# EAGLE design in4_control_v1.0_revA (EAGLE 7.5.0)
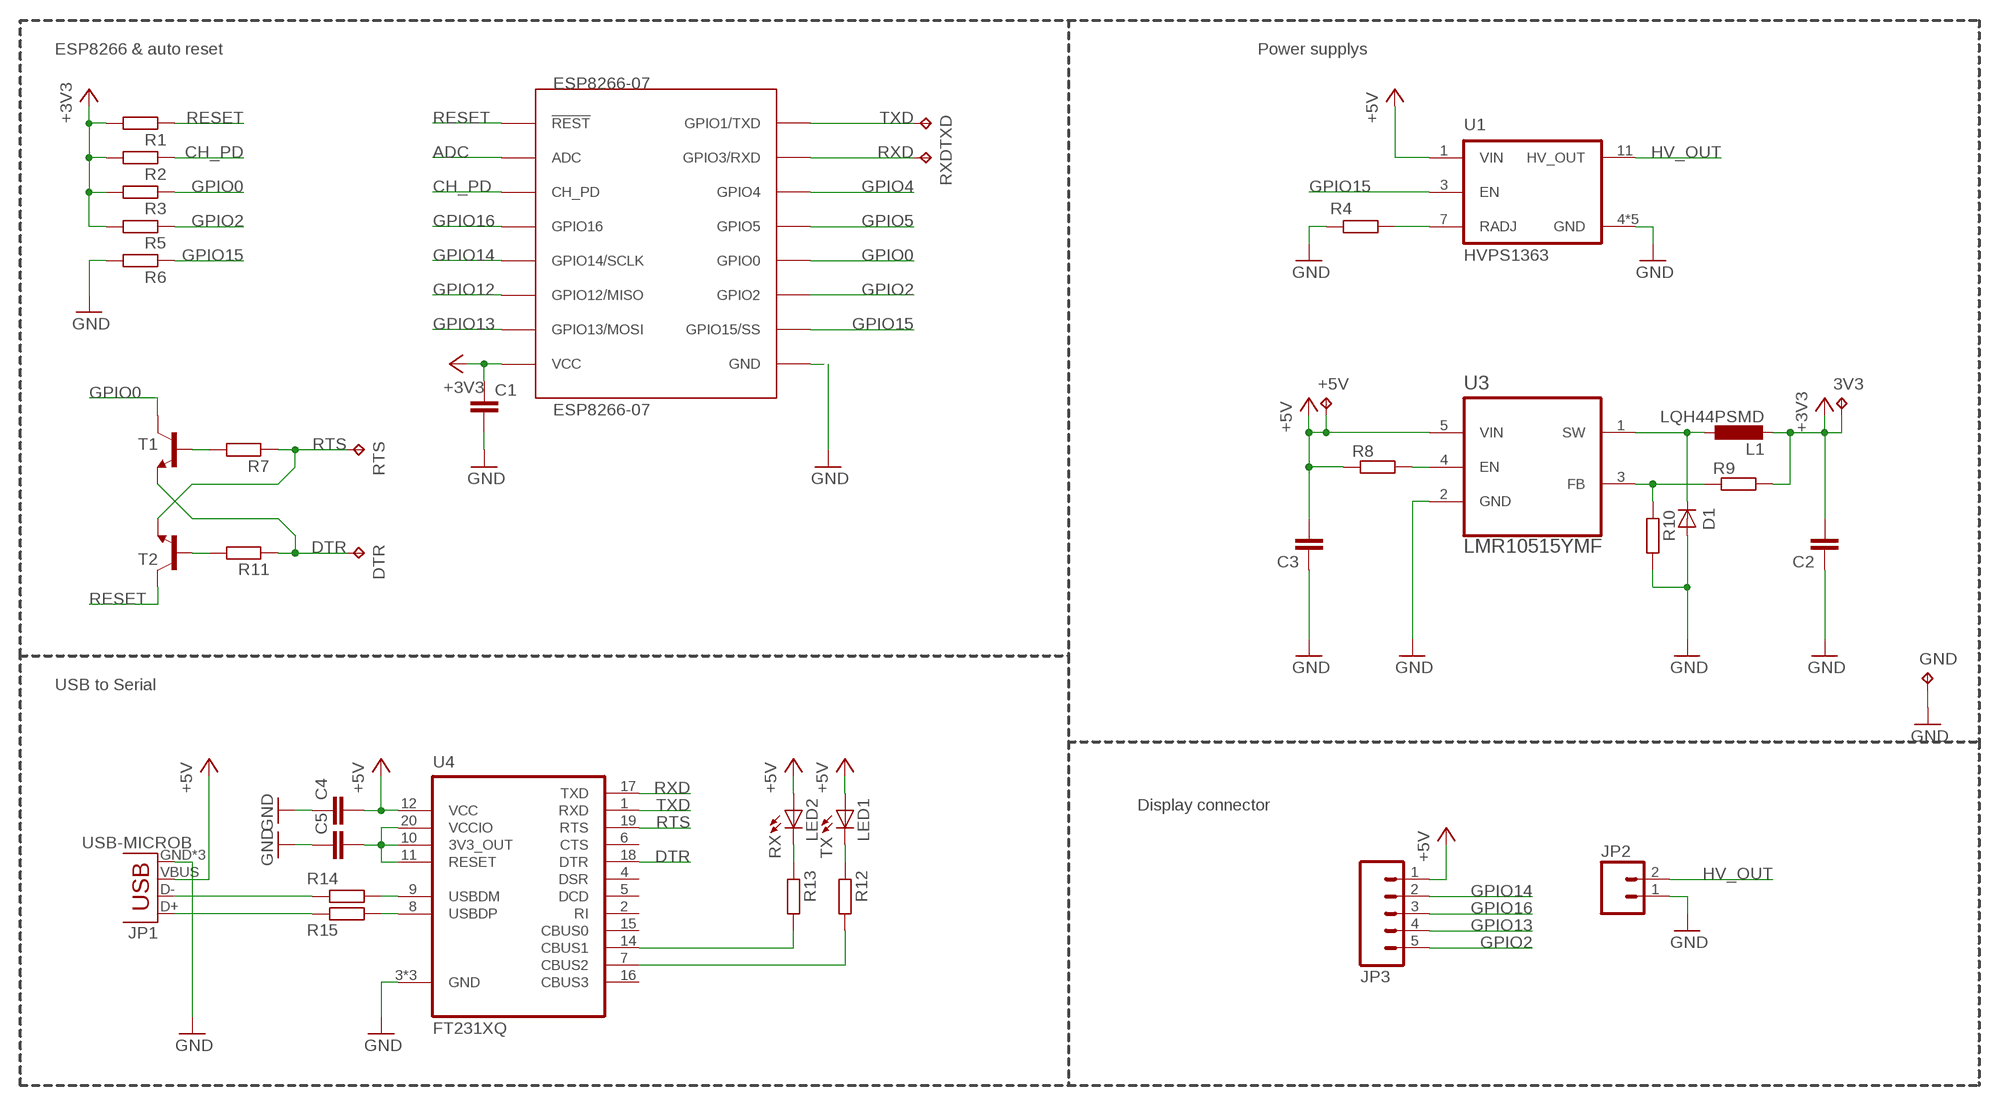
[diagram p0: schematic, sheet 1]

## Parts
3V3  TPTP15R  [TP15R]
+5V  TPTP17R  [TP17R]
C1  C-EUC0805  [C0805]
C2  C-EUC0805  [C0805]
C3  C-EUC0805  [C0805]
C4  C-EUC0603  [C0603]
C5  C-EUC0603  [C0603]
D1  DIODE-SOD-123  [SOD-123]
DTR  TPTP17R  [TP17R]
ESP8266-07  ESP8266-07  [ESP07]
GND  TPTP17R  [TP17R]
JP1  USB-MICROB  [USB-MICROB]
JP2  M021X02_NO_SILK  [1X02_NO_SILK]
JP3  M05PTH  [1X05]
L1  LQH44PSMD  [1515]
LED1  TX  LEDCHIP-LED0603  [CHIP-LED0603]
LED2  RX  LEDCHIP-LED0603  [CHIP-LED0603]
R1  R-EU_R0603  [R0603]
R2  R-EU_R0603  [R0603]
R3  R-EU_R0603  [R0603]
R4  R-EU_R0603  [R0603]
R5  R-EU_R0603  [R0603]
R6  R-EU_R0603  [R0603]
R7  R-EU_R0603  [R0603]
R8  R-EU_R0603  [R0603]
R9  R-EU_R0603  [R0603]
R10  R-EU_R0603  [R0603]
R11  R-EU_R0603  [R0603]
R12  R-EU_R0603  [R0603]
R13  R-EU_R0603  [R0603]
R14  R-EU_R0603  [R0603]
R15  R-EU_R0603  [R0603]
RTS  TPTP17R  [TP17R]
RXD  TPTP17R  [TP17R]
T1  MMBT3904LT1-NPN-SOT23-BEC  [SOT23-BEC]
T2  MMBT3904LT1-NPN-SOT23-BEC  [SOT23-BEC]
TXD  TPTP17R  [TP17R]
U1  HVPS1363  [HVPS-1363]
U3  LMR10515YMF  [SOT95P290X145-5N]
U4  FT231XQ  [QFN-20]

## Nets
+3V3: 3V3.TP C1.1 C2.2 ESP8266-07.VCC L1.2 R1.2 R2.2 R3.2 R5.2 R9.2
+5V: +5V.TP C3.2 C4.2 JP1.VBUS JP3.1 LED1.A LED2.A R8.1 U1.1(VIN) U3.5(VIN) U4.12(VCC)
ADC: ESP8266-07.ADC
CH_PD: ESP8266-07.CH_PD R2.1
DTR: DTR.TP R11.1 T1.E U4.18(DTR)
GND: C1.2 C2.1 C3.1 C4.1 C5.1 D1.A ESP8266-07.GND GND.TP JP1.GND JP1.MT1(GND) JP1.MT2(GND) JP2.1 R4.2 R6.2 R10.2 U1.4(GND) U1.6(GND) U1.8(GND) U1.9(GND) U1.10(GND) U3.2(GND) U4.3(GND) U4.13(GND) U4.21(GND)
GPIO0: ESP8266-07.GPIO0 R3.1 T1.C
GPIO2: ESP8266-07.GPIO2 JP3.5 R5.1
GPIO4: ESP8266-07.GPIO4
GPIO5: ESP8266-07.GPIO5
GPIO12: ESP8266-07.GPIO12(GPIO12/MISO)
GPIO13: ESP8266-07.GPIO13(GPIO13/MOSI) JP3.4
GPIO14: ESP8266-07.GPIO14(GPIO14/SCLK) JP3.2
GPIO15: ESP8266-07.GPIO15(GPIO15/SS) R6.1 U1.3(EN)
GPIO16: ESP8266-07.GPIO16 JP3.3
HV_OUT: JP2.2 U1.11(HV_OUT)
N$2: C5.2 U4.10(3V3_OUT) U4.11(RESET) U4.20(VCCIO)
N$3: R8.2 U3.4(EN)
N$4: R9.1 R10.1 U3.3(FB)
N$5: R14.1 U4.9(USBDM)
N$6: R15.1 U4.8(USBDP)
N$7: JP1.D+ R15.2
N$8: JP1.D- R14.2
N$9: LED2.C R13.1
N$10: LED1.C R12.1
N$11: R13.2 U4.14(CBUS1)
N$12: R12.2 U4.7(CBUS2)
N$13: R4.1 U1.7(RADJ)
N$15: R11.2 T2.B
N$16: R7.2 T1.B
RESET: ESP8266-07.REST(!REST!) R1.1 T2.C
RTS: R7.1 RTS.TP T2.E U4.19(RTS)
RXD: ESP8266-07.RXD(GPIO3/RXD) RXD.TP U4.17(TXD)
SW: D1.C L1.1 U3.1(SW)
TXD: ESP8266-07.TXD(GPIO1/TXD) TXD.TP U4.1(RXD)
Unconnected: U4.2(RI) U4.4(DSR) U4.5(DCD) U4.6(CTS) U4.15(CBUS0) U4.16(CBUS3)

## Notes on the sheet
- ESP8266 & auto reset | Power supplys
- USB to Serial
- Display connector

## Library data of the parts
3V3 +5V DTR GND RTS RXD TXD = testpad:TP: Test pad
C1 C4 C5 = resistor:C-EU: CAPACITOR, European symbol
C2 C3 = rcl:C-EU: CAPACITOR, European symbol
D1 = dp_devices:DIODE: Various Diode Packages
ESP8266-07 = custom_lbr:ESP8266-07: ESP8266 - ESP07
JP1 = SparkFun-Connectors:USB: USB Connectors USB-B-PTH is fully proven SKU : PRT-00139/CONN-08278 USB-miniB is fully proven SKU : PRT-00587 USB-A-PCB is untested. USB-A-H is throughly reviewed, but untested. Spark Fun Electronics SKU : PRT-00437 USB-B-SMT is throughly reviewed, but untested. Needs silkscreen touching up. USB-A-S has not been used/tested USB-MB-H has not been used/tested USB-MICROB has been used. CONN-09505; PROD_ID: CONN-09505
JP2 = SparkFun-Connectors:M02: Standard 2-pin 0.1" header. Use with - straight break away headers ( PRT-00116) - right angle break away headers (PRT-00553) - swiss pins (PRT-00743) - machine pins (PRT-00117) - female headers (PRT-00115) Molex polarized connector foot print use with: PRT-08233 with associated crimp pins and housings. 2.54_SCREWTERM for use with PRT-10571. 3.5mm Screw Terminal footprints for PRT-08084 5mm Screw Terminal footprints for use with PRT-08432
JP3 = SparkFun-Connectors:M05: Header 5 Standard 5-pin 0.1" header. Use with straight break away headers (SKU : PRT-00116), right angle break away headers (PRT-00553), swiss pins (PRT-00743), machine pins (PRT-00117), and female headers (PRT-00115). Molex polarized connector foot print use with SKU : PRT-08230 with associated crimp pins and housings.
L1 = custom_lbr:LQH44P: Murat LQH44 series http://www.farnell.com/datasheets/490895.pdf
LED1 LED2 = led:LED: LED OSRAM: - CHIPLED LG R971, LG N971, LY N971, LG Q971, LY Q971, LO R971, LY R971 LH N974, LH R974 LS Q976, LO Q976, LY Q976 LO Q996 - Hyper CHIPLED LW Q18S LB Q993, LB Q99A, LB R99A - SideLED LS A670, LO A670, LY A670, LG A670, LP A670 LB A673, LV A673, LT A673, LW A673 LH A674 LY A675 LS A676, LA A676, LO A676, LY A676, LW A676 LS A679, LY A679, LG A679 - Hyper Micro SIDELED® LS Y876, LA Y876, LO Y876, LY Y876 LT Y87S - SmartLED LW L88C, LW L88S LB L89C, LB L89S, LG L890 LS L89K, LO L89K, LY L89K LS L896, LA L896, LO L896, LY L896 - TOPLED LS T670, LO T670, LY T670, LG T670, LP T670 LSG T670, LSP T670, LSY T670, LOP T670, LYG T670 LG T671, LOG T671, LSG T671 LB T673, LV T673, LT T673, LW T673 LH T674 LS T676, LA T676, LO T676, LY T676, LB T676, LH T676, LSB T676, LW T676 LB T67C, LV T67C, LT T67C, LS T67K, LO T67K, LY T67K, LW E67C LS E67B, LA E67B, LO E67B, LY E67B, LB E67C, LV E67C, LT E67C LW T67C LS T679, LY T679, LG T679 LS T770, LO T770, LY T770, LG T770, LP T770 LB T773, LV T773, LT T773, LW T773 LH T774 LS E675, LA E675, LY E675, LS T675 LS T776, LA T776, LO T776, LY T776, LB T776 LHGB T686 LT T68C, LB T68C - Hyper Mini TOPLED® LB M676 - Mini TOPLED Santana® LG M470 LS M47K, LO M47K, LY M47K Source: http://www.osram.convergy.de LUXEON: - LUMILED® LXK2-PW12-R00, LXK2-PW12-S00, LXK2-PW14-U00, LXK2-PW14-V00 LXK2-PM12-R00, LXK2-PM12-S00, LXK2-PM14-U00 LXK2-PE12-Q00, LXK2-PE12-R00, LXK2-PE12-S00, LXK2-PE14-T00, LXK2-PE14-U00 LXK2-PB12-K00, LXK2-PB12-L00, LXK2-PB12-M00, LXK2-PB14-N00, LXK2-PB14-P00, LXK2-PB14-Q00 LXK2-PR12-L00, LXK2-PR12-M00, LXK2-PR14-Q00, LXK2-PR14-R00 LXK2-PD12-Q00, LXK2-PD12-R00, LXK2-PD12-S00 LXK2-PH12-R00, LXK2-PH12-S00 LXK2-PL12-P00, LXK2-PL12-Q00, LXK2-PL12-R00 Source: www.luxeon.com KINGBRIGHT: KA-3528ASYC Source: www.kingbright.com
R1-R15 = rcl:R-EU_: RESISTOR, European symbol
T1 T2 = transistor:*-NPN-: NPN Transistror BF959 corrected 2008.03.06
U1 = custom_lbr:HVPS1363: 1363 HVPS http://www.tayloredge.com/
U3 = custom_lbr:LMR10515YMF: IC, SIMPLE SWITCHER 5.5Vin, 1.5A Step-Down Voltage Regulator in SOT-23-5; MPN: LMR10515YMF; OC_FARNELL: 2064684; OC_NEWARK: 75T7391; PACKAGE: SOT-23-5; SUPPLIER: TEXAS INSTRUMENTS
U4 = custom_lbr:FT231XQ: FTDI FT231XQ USB Interface

## Net classes
1 HV: width 0.61 mm, drill 0.33 mm, clearance 0.406 mm

## Board
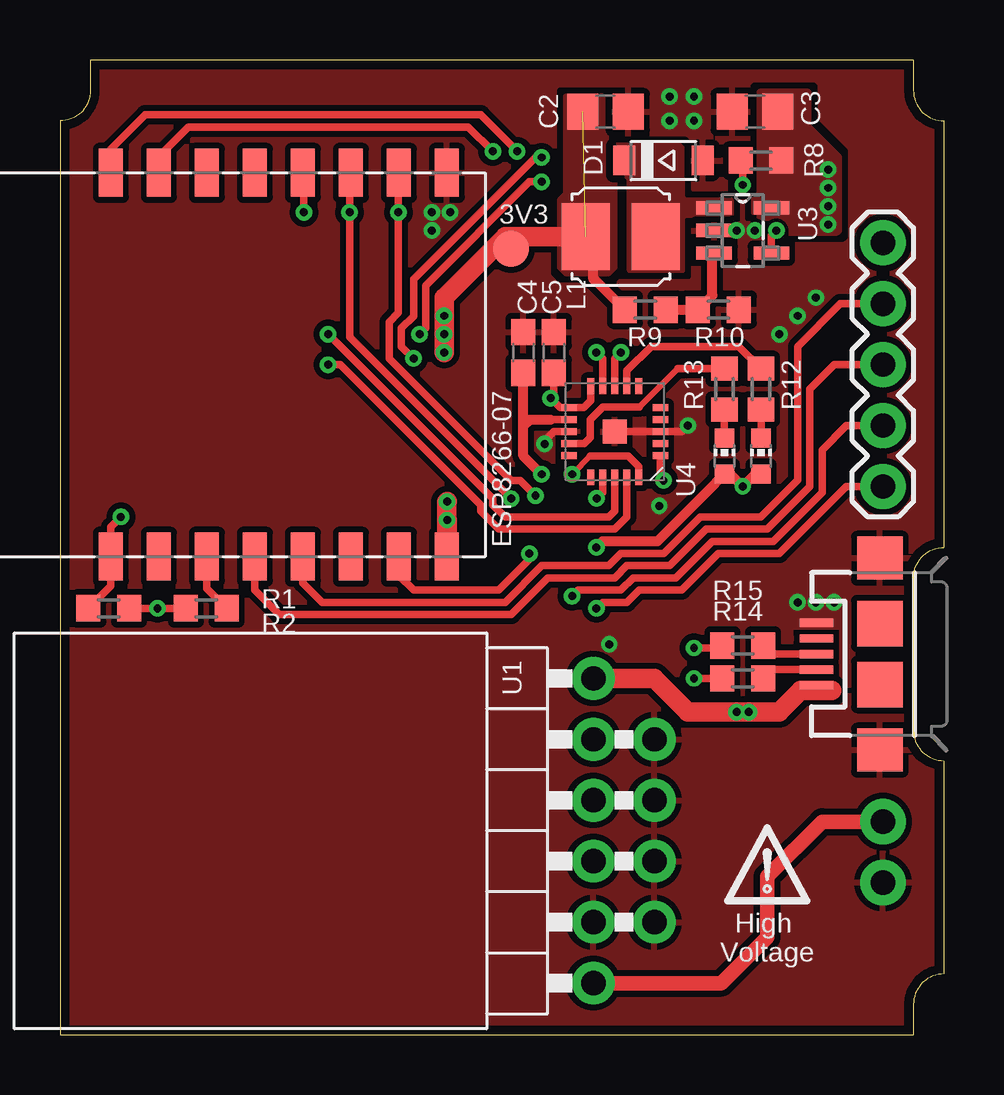
[diagram p1: board, top side]
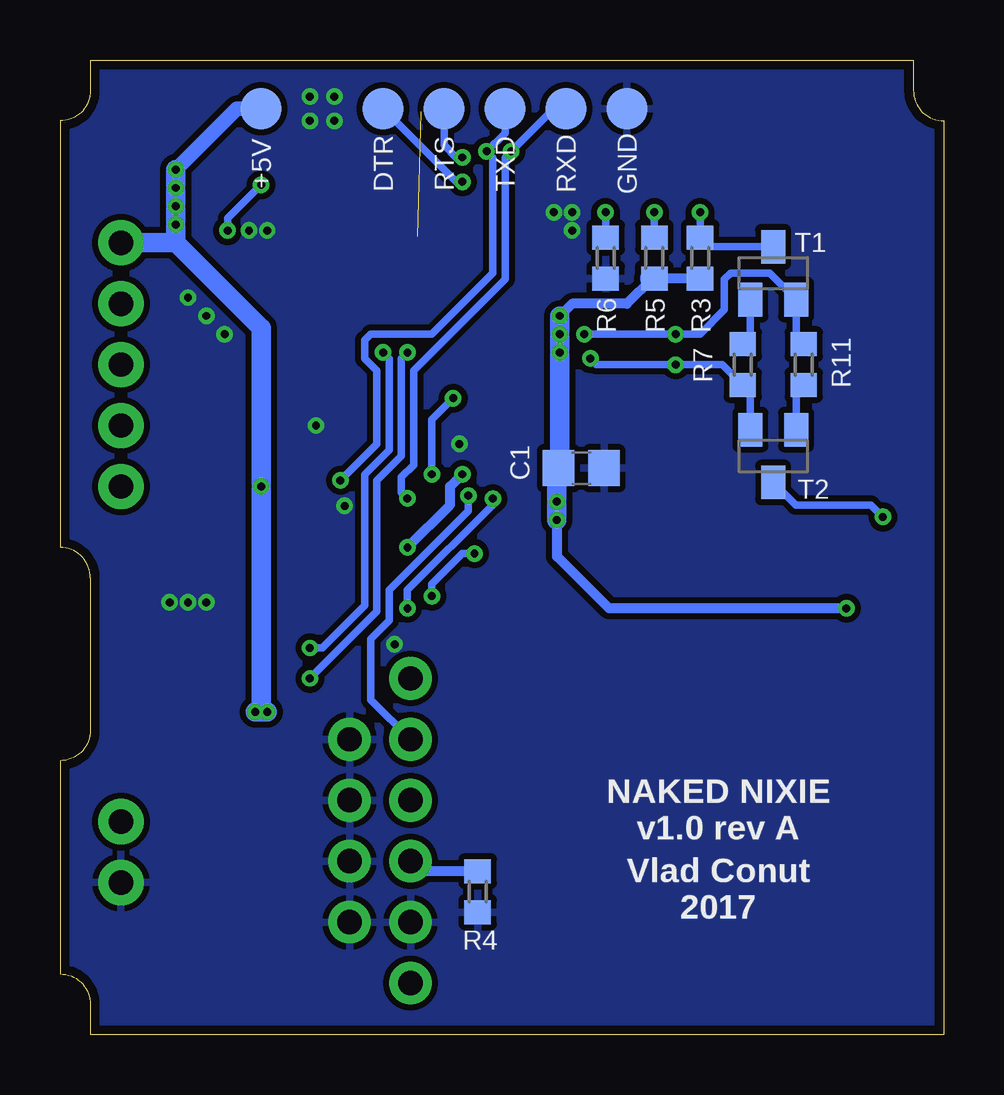
[diagram p2: board, bottom side, seen from below]

Size 36.83 x 40.64 mm. Coordinates in mm from the lower left corner, seen from the top.
Outline: 0,0 35.56,0 35.56,1.27 arc-90 36.83,2.54 36.83,11.43 arc-90 35.56,12.7 35.56,19.05 arc-90 36.83,20.32 36.83,38.1 arc-90 35.56,39.37 35.56,40.64 1.27,40.64 1.27,39.37 arc-90 0,38.1 0,0
Copper layers (1*16): Top 0.0356mm / dielectric 1.5288mm / Bottom 0.0356mm
Design rules "OSHPARK_mod *": minimum track width 6mil, minimum drill 13mil, track to track 6mil, track to pad 6mil, pad to pad 6mil, via to via 6mil, smd to smd 0mil, copper to edge 15mil, drill to drill 6mil, minimum pad ring 10mil, minimum via ring 7mil, stop-mask expansion 3mil, vias tented up to drill 20mil, thermal gap 10mil

### Footprints (pad centres in the part's own frame; a part is rotated, then mirrored left to right if it is on the bottom)
TP15R = smd 1.5 x 1.5: TP 0,0
TP17R = smd 1.7 x 1.7: TP 0,0
C0805 = smd 1.3 x 1.5: 1 -0.95,0; 2 0.95,0
C0603 = smd 1.1 x 1: 1 -0.85,0; 2 0.85,0
SOD-123 = smd 0.91 x 1.22: A 1.635,0; C -1.635,0
ESP07 = smd 1 x 2: ADC -2.87,-8; CH_PD -0.87,-8; GND 9.13,8; GPIO0 3.13,8; GPIO2 5.13,8; GPIO4 -0.87,8; GPIO5 1.13,8; GPIO12 5.13,-8; GPIO13 7.13,-8; GPIO14 3.13,-8; GPIO15 7.13,8; GPIO16 1.13,-8; REST -4.87,-8; RXD -2.87,8; TXD -4.87,8; VCC 9.13,-8
USB-MICROB = smd 0.35 x 1.4: D+ 0,2.65; D- -0.65,2.65; GND 1.3,2.65; ID 0.65,2.65; VBUS -1.3,2.65 | smd 1.8 x 1.9: MT1 -4,0; MT2 4,0 | smd 1.9 x 1.9: P$1 -1.27,0; P$2 1.27,0
1X02_NO_SILK = drill 1.016 pad 1.88: 1 0,0; 2 2.54,0
1X05 = drill 1.016 pad 1.88: 1 0,0; 2 2.54,0; 3 5.08,0; 4 7.62,0; 5 10.16,0
1515 = smd 2 x 2.8: 1 -1.454,0; 2 1.454,0
CHIP-LED0603 = smd 0.8 x 0.8: A 0,-0.75; C 0,0.75
R0603 = smd 1 x 1.1: 1 -0.85,0; 2 0.85,0
SOT23-BEC = smd 1 x 1.4: B -0.95,-1.1; C 0,1.1; E 0.95,-1.1
HVPS-1363 = drill 1.016 pad 1.778: 1 0,-6.35; 3 0,-3.81; 4 -2.54,-3.81; 5 0,-1.27; 6 -2.54,-1.27; 7 0,1.27; 8 -2.54,1.27; 9 0,3.81; 10 -2.54,3.81; 11 0,6.35
SOT95P290X145-5N = smd 1.473 x 0.559: 1 -1.194,0.94; 2 -1.194,0; 3 -1.194,-0.94; 4 1.194,-0.94; 5 1.194,0.94
QFN-20 = smd 0.65 x 0.3: 1 -1.9,1; 2 -1.9,0.5; 3 -1.9,0; 4 -1.9,-0.5; 5 -1.9,-1; 11 1.9,-1; 12 1.9,-0.5; 13 1.9,0; 14 1.9,0.5; 15 1.9,1 | smd 0.3 x 0.65: 6 -1,-1.9; 7 -0.5,-1.9; 8 0,-1.9; 9 0.5,-1.9; 10 1,-1.9; 16 1,1.9; 17 0.5,1.9; 18 0,1.9; 19 -0.5,1.9; 20 -1,1.9 | smd 1 x 1: 21 0,0

### Placement (x,y rotation side)
3V3  18.8,32.77 0 top
+5V  28.45,38.61 0 bottom
C1  15.11,23.62 0 bottom
C2  22.73,38.48 180 top
C3  28.96,38.48 0 top
C4  19.3,28.45 270 top
C5  20.57,28.45 270 top
D1  25.15,36.45 0 top
DTR  23.37,38.61 0 bottom
ESP8266-07  6.99,27.94 0 top
GND  13.21,38.61 0 bottom
JP1  34.16,15.88 90 top
JP2  34.29,6.35 90 top
JP3  34.29,33.02 270 top
L1  23.37,33.27 180 top
LED1  29.21,24.13 0 top
LED2  27.69,24.13 0 top
R1  2.03,17.78 0 top
R2  6.1,17.78 180 top
R3  10.16,32.38 270 bottom
R4  19.43,5.97 270 bottom
R5  12.06,32.38 270 bottom
R6  14.1,32.38 270 bottom
R7  8.38,27.94 90 bottom
R8  29.21,36.45 180 top
R9  24.38,30.23 180 top
R10  27.43,30.23 0 top
R11  5.84,27.94 270 bottom
R12  29.21,26.92 90 top
R13  27.69,26.92 90 top
R14  28.45,14.86 0 top
R15  28.45,16.23 0 top
RTS  20.83,38.61 0 bottom
RXD  15.75,38.61 0 bottom
T1  7.11,31.75 0 bottom
T2  7.11,24.13 180 bottom
TXD  18.29,38.61 0 bottom
U1  22.23,8.51 180 top
U3  28.45,33.53 0 top
U4  23.11,25.15 180 top
U$1  [DANGER_LOGO]  29.46,6.1 0 top

### Tracks (layer width: path | path; a pad name or v marks a point on that pad's centre or on a via)
+3V3  (via drill 0.33)  (1 unrouted)
  Top 0.305: R1.2 v4.06,17.78 R2.2
  Top 0.406: 23.5,30.23 R9.2 22.26,31.5 22.23,31.5 22.23,32.96 L1.2
  Top 0.813: v16,28.45 v16,29.21 v16,29.97 16,30.73 18.54,33.27 18.8,33.27 | v16.13,22.23 16.11,22.21 ESP8266-07.VCC 16.13,19.95 v16.13,21.46 | L1.2 18.8,33.27 | 3V3.TP 18.8,33.27
  Bottom 0.406: v4.06,17.78 13.96,17.78 ESP8266-07.VCC 16.11,21.45 v16.13,21.46 | R3.2 R5.2 | 12.15,31.54 13.21,30.48 15.49,30.48 v16,29.97
  Bottom 0.813: v16,29.97 v16,29.21 v16,28.45 16,23.68 C1.1 16.13,23.56 v16.13,21.46
  Bottom 1.016: R5.2 12.15,31.54
  pour Top (isolate 0.305, no thermals): 21.08,39.12 21.08,35.05 20.83,34.8 20.83,32 21.08,31.75 22.86,31.75 23.11,32 23.11,37.59 22.61,38.1 22.61,39.12
+5V  (via drill 0.33)
  Top 0.254: 31.69,14.57 32.15,14.37 | JP1.VBUS 31.51,14.37 31.5,14.35 | LED2.A 27.93,23.38 | LED1.A 28.97,23.38
  Top 0.305: U4.12 20.33,25.65 20.45,25.64
  Top 0.406: LED2.A 26.92,22.61 24.89,20.57 22.61,20.57 v22.35,20.32 | v20.07,23.37 19.3,24.13 19.3,25.4 | 19.3,25.4 C4.2 | 27.93,23.38 v28.45,22.86 28.97,23.38 | 20.45,25.64 19.54,25.64 19.3,25.4
  Top 0.813: 32.15,14.37 31.62,14.35 31.5,14.35 30.86,14.35 29.97,13.46 v28.7,13.46 v28.19,13.46 26.16,13.46 24.77,14.86 U1.1
  Bottom 0.406: v22.35,20.32 20.57,22.1 20.57,22.86 v20.07,23.37
  Bottom 0.61: +5V.TP 29.46,38.61 v32,36.07
  Bottom 0.813: 32,33.02 28.45,29.46 v28.45,22.86 28.45,13.72 v28.19,13.46 v28.7,13.46 | 32,33.02 v32,33.78 v32,34.54 v32,35.31 v32,36.07 | JP3.1 32,33.02
  pour Top (isolate 0.254, no thermals): 28.96,34.29 28.96,34.8 29.21,34.8
  pour Top (no thermals): 29.21,39.24 29.21,33.53 32.38,33.53 32.38,36.58 31.11,37.85 31.11,39.24
CH_PD
  Top 0.305: ESP8266-07.CH_PD 6.12,18.61 R2.1
DTR  (via drill 0.33)
  Top 0.305: U4.18 23.11,21.84 22.86,21.59 18.54,21.59 18.03,22.1 18.03,22.35 v11.18,29.21 | v14.99,29.21 15.24,29.46 15.24,31.24 19.56,35.56 v20.07,35.56
  Bottom 0.305: 6.1,30.58 T1.E | T1.E 6.16,29.11 R11.1 | v14.99,29.21 v11.18,29.21 10.16,29.21 9.14,30.23 9.14,31.5 8.89,31.75 7.26,31.75 T1.E | v20.07,35.56 20.32,35.56 DTR.TP
GND  (via drill 0.33)
  Top 0.305: U4.13 20.57,25.15 20.32,24.89 | U4.3 U4.21 25.91,25.15 v26.16,25.4
  other vias: 28.19,33.53 28.96,33.53 20.19,24.64 25.4,39.12 25.4,38.1 26.42,38.1 26.42,39.12 30.73,18.03 31.5,18.03 32.26,18.03 29.97,29.21 30.73,29.97 31.5,30.73 24.97,22.05 22.89,16.28 15.49,33.53 15.49,34.29 16.26,34.29
  pour Top (isolate 0.254, rank 6): 0,40.64 36.83,40.64 36.83,0 0,0
  pour Bottom (isolate 0.254, rank 6): 0,40.64 36.83,40.64 36.83,0 0,0
  pour Top (no thermals): 30.48,18.29 30.48,17.02 32.51,17.02 32.51,18.54 30.48,18.54
GPIO0  (via drill 0.33)
  Top 0.305: v10.16,34.29 10.16,35.9
  Top 0.406: 10.16,35.9 ESP8266-07.GPIO0
  Bottom 0.305: v10.16,34.29 R3.1 9.78,32.85 T1.C
GPIO2  (via drill 0.33)
  Top 0.305: 12.06,35.89 v12.06,34.29 12.06,29.08 v18.8,22.35 | JP3.5 32.77,22.86 29.97,20.07 27.43,20.07 25.91,18.54 24.13,18.54 23.62,18.03 22.61,18.03 v22.35,17.78
  Top 0.406: 12.06,35.89 ESP8266-07.GPIO2
  Bottom 0.305: R5.1 v12.06,34.29 | v22.35,17.78 22.35,18.54 18.8,22.1 v18.8,22.35
GPIO13  (via drill 0.33)
  Top 0.305: JP3.4 32.77,25.4 31.75,24.38 31.75,22.61 29.72,20.57 27.18,20.57 25.65,19.05 23.88,19.05 23.37,18.54 21.59,18.54 v21.34,18.29 | 14.12,20.46 ESP8266-07.GPIO13 14.12,19.16 14.73,18.54 18.29,18.54 19.56,19.81 v19.56,20.07
  Bottom 0.305: v19.56,20.07 20.07,20.07 21.34,18.8 v21.34,18.29
GPIO14
  Top 0.305: JP3.2 32.51,30.48 30.73,28.7 30.73,23.12 29.2,21.59 26.67,21.59 25.15,20.07 23.37,20.07 22.86,19.56 20.07,19.56 18.54,18.03 10.92,18.03 10.12,18.84 ESP8266-07.GPIO14
GPIO15  (via drill 0.33)
  Top 0.305: ESP8266-07.GPIO15 14.1,35.92 v14.1,34.29 14.1,30.1 13.72,29.72 13.72,28.19 18.8,23.11 19.18,23.11 v19.81,22.48
  Bottom 0.305: R6.1 v14.1,34.29 | v19.81,22.48 19.81,21.84 23.11,18.54 23.11,17.27 23.88,16.51 23.88,13.97 U1.3
GPIO16
  Top 0.305: JP3.3 32.26,27.94 31.24,26.92 31.24,22.86 29.46,21.08 26.92,21.08 25.4,19.56 23.62,19.56 23.11,19.05 20.32,19.05 18.8,17.53 9.14,17.53 8.12,18.55 ESP8266-07.GPIO16
HV_OUT
  Top 0.61: JP2.2 31.75,8.89 29.46,6.6 29.46,4.06 28.19,2.79 27.56,2.16 U1.11
N$2  (via drill 0.33)
  Top 0.254: 22.1,24.13 v21.34,23.37
  Top 0.305: U4.11 21.1,26.15 | U4.11 21.83,26.15 22.11,26.43 U4.10 | U4.20 24.11,23.68 23.67,24.13 22.1,24.13 | C5.2 20.57,26.67 v20.45,26.54 20.84,26.15 U4.11
  Bottom 0.305: v21.34,23.37 21.34,25.65 v20.45,26.54
N$3  (via drill 0.33)
  Top 0.305: v28.45,35.43 28.45,36.36 R8.2 | U3.4 29.64,33.33 v29.84,33.53
  Bottom 0.305: v29.84,33.53 29.84,34.04 v28.45,35.43
N$4
  Top 0.406: 26.49,30.32 R10.1 | R9.1 R10.1 | R10.1 26.58,30.27 | U3.3 27.18,32.51 27.18,30.82 R10.1
N$5  (via drill 0.33)
  Top 0.305: 22.61,28.19 v22.35,28.45 22.61,28.19 U4.9 | v26.42,14.86 R14.1
  Bottom 0.305: v22.35,28.45 22.61,28.19 22.61,24.13 23.62,23.11 23.62,17.65 v26.42,14.86
N$6  (via drill 0.33)
  Top 0.305: v23.37,28.45 23.11,28.19 U4.8 | R15.1 27.5,16.13 v26.42,16.13
  Bottom 0.305: v23.37,28.45 23.11,28.19 23.11,24.38 24.13,23.37 24.13,18.54 24.13,18.03 24.13,17.91 25.91,16.13 v26.42,16.13
N$7
  Top 0.305: JP1.D+ 29.65,15.88 R15.2
N$8
  Top 0.305: JP1.D- 29.66,15.22 R14.2
N$9
  Top 0.305: LED2.C R13.1
N$10
  Top 0.305: LED1.C R12.1
N$11
  Top 0.254: 24.13,26.16 25.74,27.77
  Top 0.305: U4.14 21.85,24.65 22.1,24.89 22.1,25.65 22.61,26.16 24.13,26.16 | R13.2 25.74,27.77
N$12
  Top 0.305: U4.7 23.62,27.05 23.62,27.69 24.64,28.7 28.28,28.7 R12.2
N$13
  Bottom 0.406: R4.1 21.8,6.82 U1.7
N$15
  Bottom 0.305: T2.B 6.16,26.77 R11.2
N$16
  Bottom 0.305: T1.B 8.06,29.11 R7.2
RESET  (via drill 0.33)
  Top 0.305: R1.1 2.12,18.71 ESP8266-07.REST 2.12,21.16 v2.54,21.59
  Bottom 0.305: v2.54,21.59 3.05,22.1 6.18,22.1 T2.C
RTS  (via drill 0.33)
  Top 0.305: U4.19 23.61,21.58 23.11,21.08 18.29,21.08 17.53,21.84 17.53,22.1 11.68,27.94 v11.18,27.94 | v14.73,28.19 14.22,28.7 14.22,29.46 14.73,29.97 14.73,31.5 19.81,36.58 v20.07,36.58
  Bottom 0.305: T2.E 8.06,26.77 R7.1 | 8.13,27.34 R7.1 | v14.73,28.19 14.48,27.94 v11.18,27.94 9.23,27.94 R7.1 | RTS.TP 20.83,37.08 20.32,36.58 v20.07,36.58
RXD  (via drill 0.33)
  Top 0.305: U4.17 22.61,22.61 v22.36,22.36 | v18.03,36.83 17.02,37.85 5.33,37.85 4.06,36.58 4.06,35.99 ESP8266-07.RXD
  Bottom 0.305: v22.36,22.36 22.61,22.61 22.61,23.24 U4.17 22.1,23.76 22.1,27.69 18.29,31.5 18.29,36.58 v18.03,36.83 16.26,38.61 RXD.TP
SW
  pour Top (isolate 0.305, rank 2, no thermals): 27.94,34.16 26.04,34.16 25.91,34.04 25.91,31.88 23.75,31.88 23.75,35.69 23.62,35.81 22.99,35.81 22.99,37.08 25.78,37.08 25.91,36.96 25.91,34.92 26.04,34.8 27.94,34.8
TXD  (via drill 0.33)
  Top 0.305: U4.1 25.01,23.25 v25.15,23.11 | ESP8266-07.TXD 2.12,36.91 3.56,38.35 17.53,38.35 v19.05,36.83
  Bottom 0.305: v25.15,23.11 23.62,24.64 23.62,27.69 24.13,28.19 24.13,28.96 23.88,29.21 21.34,29.21 18.8,31.75 18.8,36.58 v19.05,36.83 18.29,37.59 TXD.TP

### Text on the board
tPlace: High / Voltage
bPlace: NAKED NIXIE / v1.0 rev A | Vlad Conut / 2017